# Altium schematic sheet Z7_FUNCTION3.SchDoc
size A3
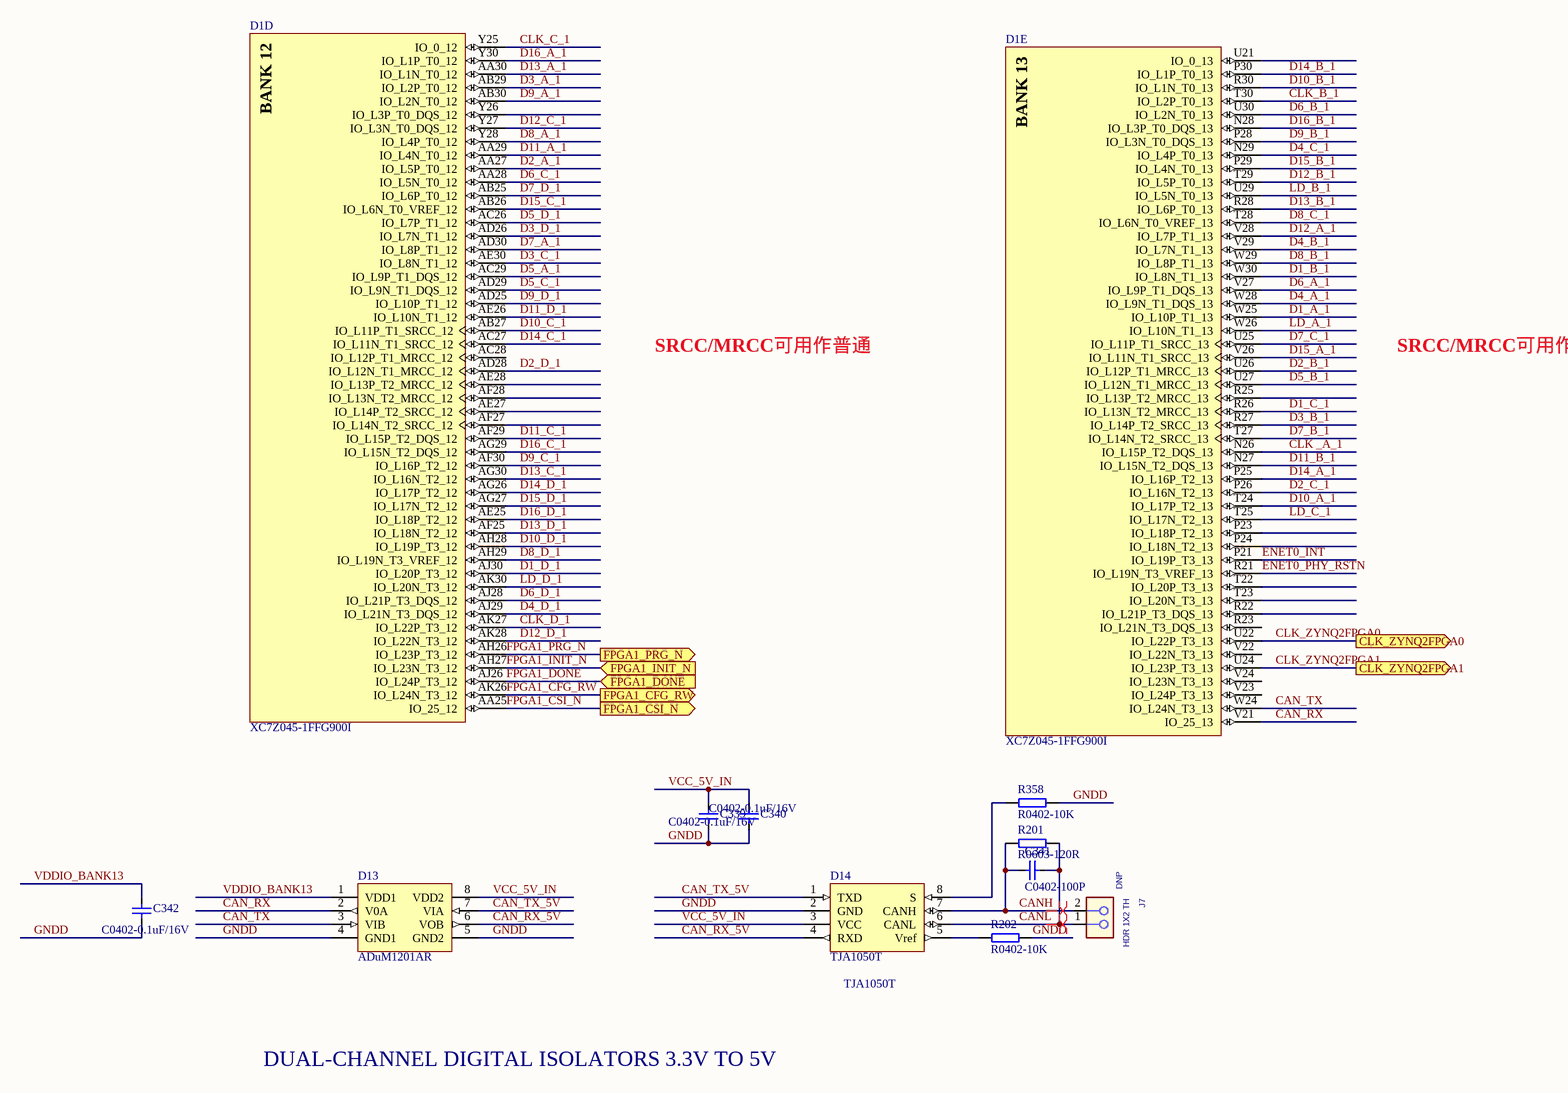
[diagram p0: Z7_FUNCTION3.SchDoc]

## Parts
C339  C0402-0.1uF/16V  [C0402]
C340  C0402-0.1uF/16V  [C0402]
C341  C0402-100P  [C0402]
C342  C0402-0.1uF/16V  [C0402]
D1  XC7Z045-1FFG900I  [FFG900]  (parts D,E of 16)
D13  ADuM1201AR  [SOIC-8]
D14  TJA1050T  [SOIC-8]
J7  HDR 1X2 TH  ASSY_OPT: DNP  [HDR102]
R201  R0603-120R  [R0603]
R202  R0402-10K  [R0402]
R358  R0402-10K  [R0402]

## Ports
CLK_ZYNQ2FPGA0 (out), CLK_ZYNQ2FPGA1 (out), FPGA1_CFG_RW (out), FPGA1_CSI_N (out), FPGA1_DONE (in), FPGA1_INIT_N (in), FPGA1_PRG_N (out)

## Nets
CAN_RX: D1.V21(IO_25_13) D13.2(V0A)
CAN_RX_5V: D13.6(VOB) D14.4(RXD)
CAN_TX: D1.W24(IO_L24N_T3_13) D13.3(VIB)
CAN_TX_5V: D13.7(VIA) D14.1(TXD)
CANH: C341.1 D14.7(CANH) J7.2 R201.2
CANL: C341.2 D14.6(CANL) J7.1 R201.1
CLK _A_1: D1.N26(IO_L15P_T2_DQS_13)
CLK_B_1: D1.T30(IO_L2P_T0_13)
CLK_C_1: D1.Y25(IO_0_12)
CLK_D_1: D1.AK27(IO_L22P_T3_12)
CLK_ZYNQ2FPGA0: D1.U22(IO_L22P_T3_13) ; port CLK_ZYNQ2FPGA0
CLK_ZYNQ2FPGA1: D1.U24(IO_L23P_T3_13) ; port CLK_ZYNQ2FPGA1
D1_A_1: D1.W25(IO_L10P_T1_13)
D1_B_1: D1.W30(IO_L8N_T1_13)
D1_C_1: D1.R26(IO_L13N_T2_MRCC_13)
D1_D_1: D1.AJ30(IO_L20P_T3_12)
D2_A_1: D1.AA27(IO_L5P_T0_12)
D2_B_1: D1.U26(IO_L12P_T1_MRCC_13)
D2_C_1: D1.P26(IO_L16N_T2_13)
D2_D_1: D1.AD28(IO_L12N_T1_MRCC_12)
D3_A_1: D1.AB29(IO_L2P_T0_12)
D3_B_1: D1.R27(IO_L14P_T2_SRCC_13)
D3_C_1: D1.AE30(IO_L8N_T1_12)
D3_D_1: D1.AD26(IO_L7N_T1_12)
D4_A_1: D1.W28(IO_L9N_T1_DQS_13)
D4_B_1: D1.V29(IO_L7N_T1_13)
D4_C_1: D1.N29(IO_L4P_T0_13)
D4_D_1: D1.AJ29(IO_L21N_T3_DQS_12)
D5_A_1: D1.AC29(IO_L9P_T1_DQS_12)
D5_B_1: D1.U27(IO_L12N_T1_MRCC_13)
D5_C_1: D1.AD29(IO_L9N_T1_DQS_12)
D5_D_1: D1.AC26(IO_L7P_T1_12)
D6_A_1: D1.V27(IO_L9P_T1_DQS_13)
D6_B_1: D1.U30(IO_L2N_T0_13)
D6_C_1: D1.AA28(IO_L5N_T0_12)
D6_D_1: D1.AJ28(IO_L21P_T3_DQS_12)
D7_A_1: D1.AD30(IO_L8P_T1_12)
D7_B_1: D1.T27(IO_L14N_T2_SRCC_13)
D7_C_1: D1.U25(IO_L11P_T1_SRCC_13)
D7_D_1: D1.AB25(IO_L6P_T0_12)
D8_A_1: D1.Y28(IO_L4P_T0_12)
D8_B_1: D1.W29(IO_L8P_T1_13)
D8_C_1: D1.T28(IO_L6N_T0_VREF_13)
D8_D_1: D1.AH29(IO_L19N_T3_VREF_12)
D9_A_1: D1.AB30(IO_L2N_T0_12)
D9_B_1: D1.P28(IO_L3N_T0_DQS_13)
D9_C_1: D1.AF30(IO_L16P_T2_12)
D9_D_1: D1.AD25(IO_L10P_T1_12)
D10_A_1: D1.T24(IO_L17P_T2_13)
D10_B_1: D1.R30(IO_L1N_T0_13)
D10_C_1: D1.AB27(IO_L11P_T1_SRCC_12)
D10_D_1: D1.AH28(IO_L19P_T3_12)
D11_A_1: D1.AA29(IO_L4N_T0_12)
D11_B_1: D1.N27(IO_L15N_T2_DQS_13)
D11_C_1: D1.AF29(IO_L15P_T2_DQS_12)
D11_D_1: D1.AE26(IO_L10N_T1_12)
D12_A_1: D1.V28(IO_L7P_T1_13)
D12_B_1: D1.T29(IO_L5P_T0_13)
D12_C_1: D1.Y27(IO_L3N_T0_DQS_12)
D12_D_1: D1.AK28(IO_L22N_T3_12)
D13_A_1: D1.AA30(IO_L1N_T0_12)
D13_B_1: D1.R28(IO_L6P_T0_13)
D13_C_1: D1.AG30(IO_L16N_T2_12)
D13_D_1: D1.AF25(IO_L18N_T2_12)
D14_A_1: D1.P25(IO_L16P_T2_13)
D14_B_1: D1.P30(IO_L1P_T0_13)
D14_C_1: D1.AC27(IO_L11N_T1_SRCC_12)
D14_D_1: D1.AG26(IO_L17P_T2_12)
D15_A_1: D1.V26(IO_L11N_T1_SRCC_13)
D15_B_1: D1.P29(IO_L4N_T0_13)
D15_C_1: D1.AB26(IO_L6N_T0_VREF_12)
D15_D_1: D1.AG27(IO_L17N_T2_12)
D16_A_1: D1.Y30(IO_L1P_T0_12)
D16_B_1: D1.N28(IO_L3P_T0_DQS_13)
D16_C_1: D1.AG29(IO_L15N_T2_DQS_12)
D16_D_1: D1.AE25(IO_L18P_T2_12)
ENET0_INT: D1.P21(IO_L19P_T3_13)
ENET0_PHY_RSTN: D1.R21(IO_L19N_T3_VREF_13)
FPGA1_CFG_RW: D1.AK26(IO_L24N_T3_12) ; port FPGA1_CFG_RW
FPGA1_CSI_N: D1.AA25(IO_25_12) ; port FPGA1_CSI_N
FPGA1_DONE: D1.AJ26(IO_L24P_T3_12) ; port FPGA1_DONE
FPGA1_INIT_N: D1.AH27(IO_L23N_T3_12) ; port FPGA1_INIT_N
FPGA1_PRG_N: D1.AH26(IO_L23P_T3_12) ; port FPGA1_PRG_N
GNDD: C339.1 C340.1 C342.1 D13.4(GND1) D13.5(GND2) D14.2(GND) R202.2 R358.2
LD_A_1: D1.W26(IO_L10N_T1_13)
LD_B_1: D1.U29(IO_L5N_T0_13)
LD_C_1: D1.T25(IO_L17N_T2_13)
LD_D_1: D1.AK30(IO_L20N_T3_12)
VCC_5V_IN: C339.2 C340.2 D13.8(VDD2) D14.3(VCC)
VDDIO_BANK13: C342.2 D13.1(VDD1)
NetD14_5: D14.5(Vref) R202.1
NetD14_8: D14.8(S) R358.1

Not connected (* = marked no-connect by the designer): D1 AC28(IO_L12P_T1_MRCC_12) AE27(IO_L14P_T2_SRCC_12) AE28(IO_L13P_T2_MRCC_12) AF27(IO_L14N_T2_SRCC_12) AF28(IO_L13N_T2_MRCC_12) P23(IO_L18P_T2_13) P24(IO_L18N_T2_13) R22(IO_L21P_T3_DQS_13) R23(IO_L21N_T3_DQS_13) R25(IO_L13P_T2_MRCC_13) T22(IO_L20P_T3_13) T23(IO_L20N_T3_13) U21(IO_0_13) V22(IO_L22N_T3_13) V23(IO_L24P_T3_13) V24(IO_L23N_T3_13) Y26(IO_L3P_T0_DQS_12)

## Layout directives
differential pair: CANH, CANL

## Notes on the sheet
- SRCC/MRCC可用作普通
- DUAL-CHANNEL DIGITAL ISOLATORS 3.3V TO 5V
- (in symbol XC7Z045-1FFG900I, part D) BANK 12
- (in symbol XC7Z045-1FFG900I, part E) BANK 13

## Library data of the parts
C339-C342 = C0402-0.1uF/16V: X7R; Manufacturer: SAMSUNG; Manufacturer_p/n: CL05X7R104KO5NNN; Part_type: CAP; temperature: -55℃\+125℃; Schematic_Part: CAP; PCB_Footprint: C0402; datasheet: #DataSheet\C_Samsung_General Capacitors.pdf#
  C339 C340 C342: Part_number: C0402-0.1uF/16V; Value: C0402-0.1uF/16V
  C341: Part_number: C0402-100P; Value: C0402-100P
D1 = XC7Z045-1FFG900I: 667 MHz Zynq?7000 AP SoC, 130 PS I/O, 378 FPGA I/O, 900-Ball BGA, Speed Grade 1, Industrial Grade, Pb-Free; Manufacturer: Xilinx; Extensible Block RAM (# 36Kb Blocks): 2180 KB (545); Flip Flops: 437200; LUTs: 218600; Speed Grade: -1; DatasheetVersion: v1.2; PackageVersion: Rev 1.1; PackageReference: FFG900; PackageDescription: Flip-Chip BGA, Body 31 x 31 mm, 1.0 mm Pitch; Generic Part Number: XC7Z045; RoHS: Pb-Free; Mounting Technology: Surface Mount; Code_JEDEC: MS-034-AAN-1; PartNumber: XC7Z045-1FFG900I; ComponentLink1Description: Datasheet; ComponentLink1URL: http://www.xilinx.com/support/documentation/data_sheets/ds190-Zynq-7000-Overview.pdf; ComponentLink2Description: Package Specification; ComponentLink2URL: http://www.xilinx.com/support/documentation/user_guides/ug865-Zynq-7000-Pkg-Pinout.pdf; ComponentLink3Description: DC and AC Switching Characteristics; ComponentLink3URL: http://www.xilinx.com/support/documentation/data_sheets/ds191-XC7Z030-XC7Z045-data-sheet.pdf; ComponentLink4Description: Package File; ComponentLink4URL: http://www.xilinx.com/support/packagefiles/z7packages/xc7z045ffg900pkg.txt; ComponentLink5Description: Packaging and Pinout; ComponentLink5URL: http://www.xilinx.com/support/documentation/user_guides/ug865-Zynq-7000-Pkg-Pinout.pdf; ComponentLink6Description: PCB and Layout Guide; ComponentLink6URL: http://www.xilinx.com/support/documentation/user_guides/ug483_7Series_PCB.pdf
D13 = ADuM1201AR: Quad-Channel Digital Isolators; Part_type: IC-SMD; Part_number: ADuM1201AR; Value: ADuM1201AR; Schematic_Part: ADuM1201AR; PCB_Footprint: SOIC-8
D14 = TJA1050T: 以太网芯片，high speed CAN transceiver,3.3V,SO-8PIN; Part_type: IC-SMD; Manufacturer: PHILIPS; Part_number: TJA1050T; Value: TJA1050T; Temperature: -40℃\+125℃; Schematic_Part: TJA1050; PCB_Footprint: SOIC-8; datasheet: #Datasheet\IC_PHILIPS_TJA1050T.pdf#
J7 = CONN_HDR_2X1: HDR 1X2 TH 100MIL SP 339H AU 98L; CLASS: IO; CAD_APPROVED: YES; MFG_PN01: TSW-102-07-G-S; MFG_NAME01: SAMTEC; AGILE_PN: 210-75439; HEIGHT: 8.71 MM; ROHS: Yes
R201 = R0603-100R/1%: Manufacturer: YAGEO; Manufacturer_p/n: RC0603FR-07100R; Part_number: R0603-120R; Part_type: RES; Value: R0603-120R; Schematic_Part: RES; PCB_Footprint: R0603; Manufacturer_p/n2: SAMSUNG; datasheet: Datasheet\R_YAGEO#Datasheet\R_YAGEO#
R202 R358 = R0402-10K: Manufacturer: SAMSUNG; Part_number: R0402-10K; Part_type: RES; Value: R0402-10K; Schematic_Part: RES; PCB_Footprint: R0402